# Altium schematic sheet 03-PeripheralPart-V2.4.SchDoc
size A4
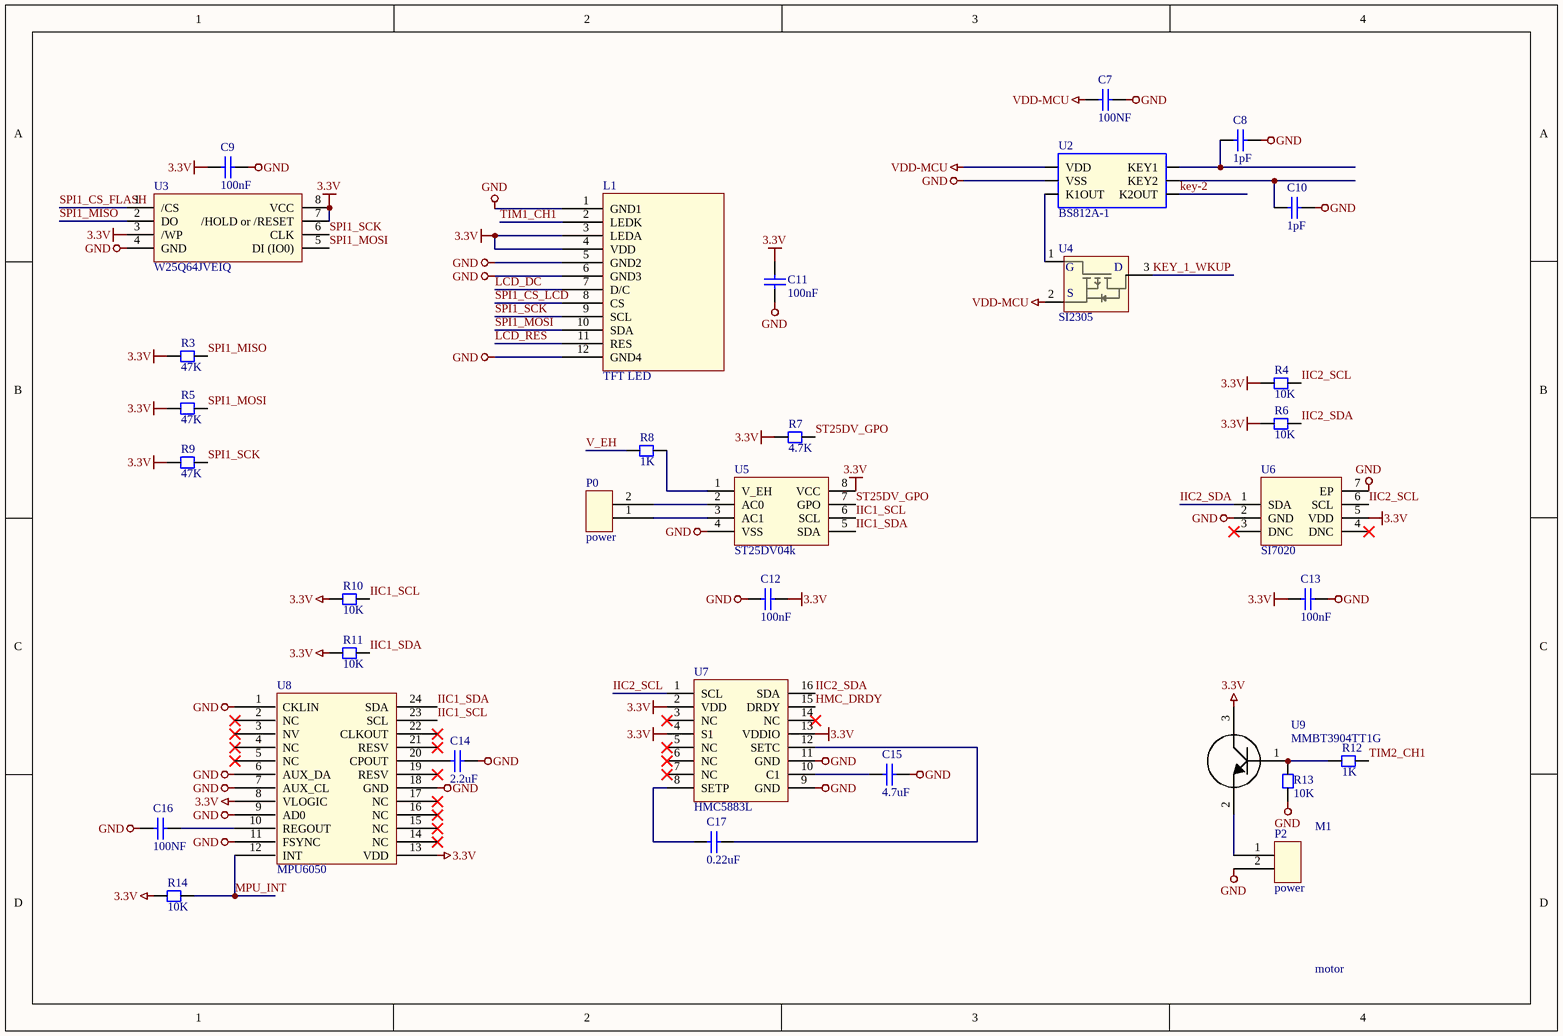
[diagram p0: 03-PeripheralPart-V2.4.SchDoc]

## Parts
C7  100NF  [CC1005-0402]
C8  1pF  [CC1005-0402]
C9  100nF  [CC1005-0402]
C10  1pF  [CC1005-0402]
C11  100nF  [CC1005-0402]
C12  100nF  [CC1005-0402]
C13  100nF  [CC1005-0402]
C14  2.2uF  [CC1005-0402]
C15  4.7uF  [CC1005-0402]
C16  100NF  [CC1005-0402]
C17  0.22uF  [CC1005-0402]
L1  TFT LED  [LCD-1.3-(2)]
M1  motor  [motor]
P0  power  [POWER2]
P2  power  [POWER-3.7V]
R3  47K  [CR1005-0402]
R4  10K  [CR1005-0402]
R5  47K  [CR1005-0402]
R6  10K  [CR1005-0402]
R7  4.7K  [CR1005-0402]
R8  1K  [CR1005-0402]
R9  47K  [CR1005-0402]
R10  10K  [CR1005-0402]
R11  10K  [CR1005-0402]
R12  1K  [CR1005-0402]
R13  10K  [CR1005-0402]
R14  10K  [CR1005-0402]
U2  BS812A-1  [SOT23-6]
U3  W25Q64JVEIQ  [WSON-8_L8.0-W6.10-P1.27-TL-EP]
U4  SI2305  [SOT-23]
U5  ST25DV04k  [UFDFPN8]
U6  SI7020  [DFN-6]
U7  HMC5883L  [LPCC-16_L3.0-W3.0-P0.50-BL]
U8  MPU6050  [QFN24 - duplicate]
U9  MMBT3904TT1G  [SOT-416]

## Nets
3.3V: C9.1 C11.1 C12.2 C13.1 L1.3(LEDA) L1.4(VDD) R3.2 R4.2 R5.2 R6.2 R7.1 R9.2 R10.2 R11.2 R14.2 U3.3(/WP) U3.7(/HOLD_or_/RESET) U3.8(VCC) U5.8(VCC) U6.5(VDD) U7.2(VDD) U7.4(S1) U7.13(VDDIO) U8.8(VLOGIC) U8.13(VDD) U9.3
GND: C7.1 C8.2 C9.2 C10.2 C11.2 C12.1 C13.2 C14.2 C15.2 C16.1 L1.1(GND1) L1.5(GND2) L1.6(GND3) L1.12(GND4) P2.2 R13.2 U2.2(VSS) U3.4(GND) U5.4(VSS) U6.2(GND) U6.7(EP) U7.9(GND) U7.11(GND) U8.1(CKLIN) U8.6(AUX_DA) U8.7(AUX_CL) U8.9(AD0) U8.11(FSYNC) U8.18(GND)
VDD-MCU: C7.2 U2.1(VDD) U4.2(SOURCE)
HMC_DRDY: U7.15(DRDY)
IIC1_SCL: R10.1 U5.6(SCL) U8.23(SCL)
IIC1_SDA: R11.1 U5.5(SDA) U8.24(SDA)
IIC2_SCL: R4.1 U6.6(SCL) U7.1(SCL)
IIC2_SDA: R6.1 U6.1(SDA) U7.16(SDA)
key-2: U2.4(K2OUT)
KEY_1_WKUP: U4.3(DRAIN)
LCD_DC: L1.7(D/C)
LCD_RES: L1.11(RES)
MPU_INT: R14.1 U8.12(INT)
SPI1_CS_FLASH: U3.1(/CS)
SPI1_CS_LCD: L1.8(CS)
SPI1_MISO: R3.1 U3.2(DO)
SPI1_MOSI: L1.10(SDA) R5.1 U3.5(DI_(IO0))
SPI1_SCK: L1.9(SCL) R9.1 U3.6(CLK)
ST25DV_GPO: R7.2 U5.7(GPO)
TIM1_CH1: L1.2(LEDK)
TIM2_CH1: R12.1
V_EH: R8.2
NetC8_1: C8.1 U2.6(KEY1)
NetC10_1: C10.1 U2.5(KEY2)
NetC14_1: C14.1 U8.20(CPOUT)
NetC15_1: C15.1 U7.10(C1)
NetC16_2: C16.2 U8.10(REGOUT)
NetC17_1: C17.1 U7.8(SETP)
NetC17_2: C17.2 U7.12(SETC)
NetP0_1: P0.1 U5.3(AC1)
NetP0_2: P0.2 U5.2(AC0)
NetP2_1: P2.1 U9.2
NetR8_1: R8.1 U5.1(V_EH)
NetR12_2: R12.2 R13.1 U9.1
NetU2_3: U2.3(K1OUT) U4.1(GATE)

Not connected (* = marked no-connect by the designer): U6 3(DNC)* 4(DNC)*; U7 3(NC)* 5(NC)* 6(NC)* 7(NC)* 14(NC)*; U8 2(NC)* 3(NV)* 4(NC)* 5(NC)* 14(NC)* 15(NC)* 16(NC)* 17(NC)* 19(RESV)* 21(RESV)* 22(CLKOUT)*

## Notes on the sheet
- (in symbol SI2305) G; D; S

## Library data of the parts
C7-C17 = Chip capacitor: 贴片电容
L1 = LCD-IPSscreen-1.3: 1.3寸显示屏幕
M1 = motor: 震动马达
R3-R14 = Chip resistor: 贴片电阻
U2 = BS812A-1: 触摸按键 两路 SOP23-6封装极简电路
U3 = W25Q256JVEIQ: FLASH
U4 = SI2305: PMOS场效应MOS管 SOT-23
U5 = ST25DV04k: NFC芯片4K存储空间
U6 = SI7020: 温湿度传感器芯片
U7 = HMC5883L: 三轴罗盘
U8 = MPU6050: 陀螺仪
U9 = MMBT3904TT1G: NPN 电流 - 集电极（Ic）（最大值）：200mA 电压 - 集射极击穿（最大值）：40V SOT-23-3